# EAGLE design working (EAGLE 6.4)
DATABASE: ./../BOM/logic-supply-db.txt
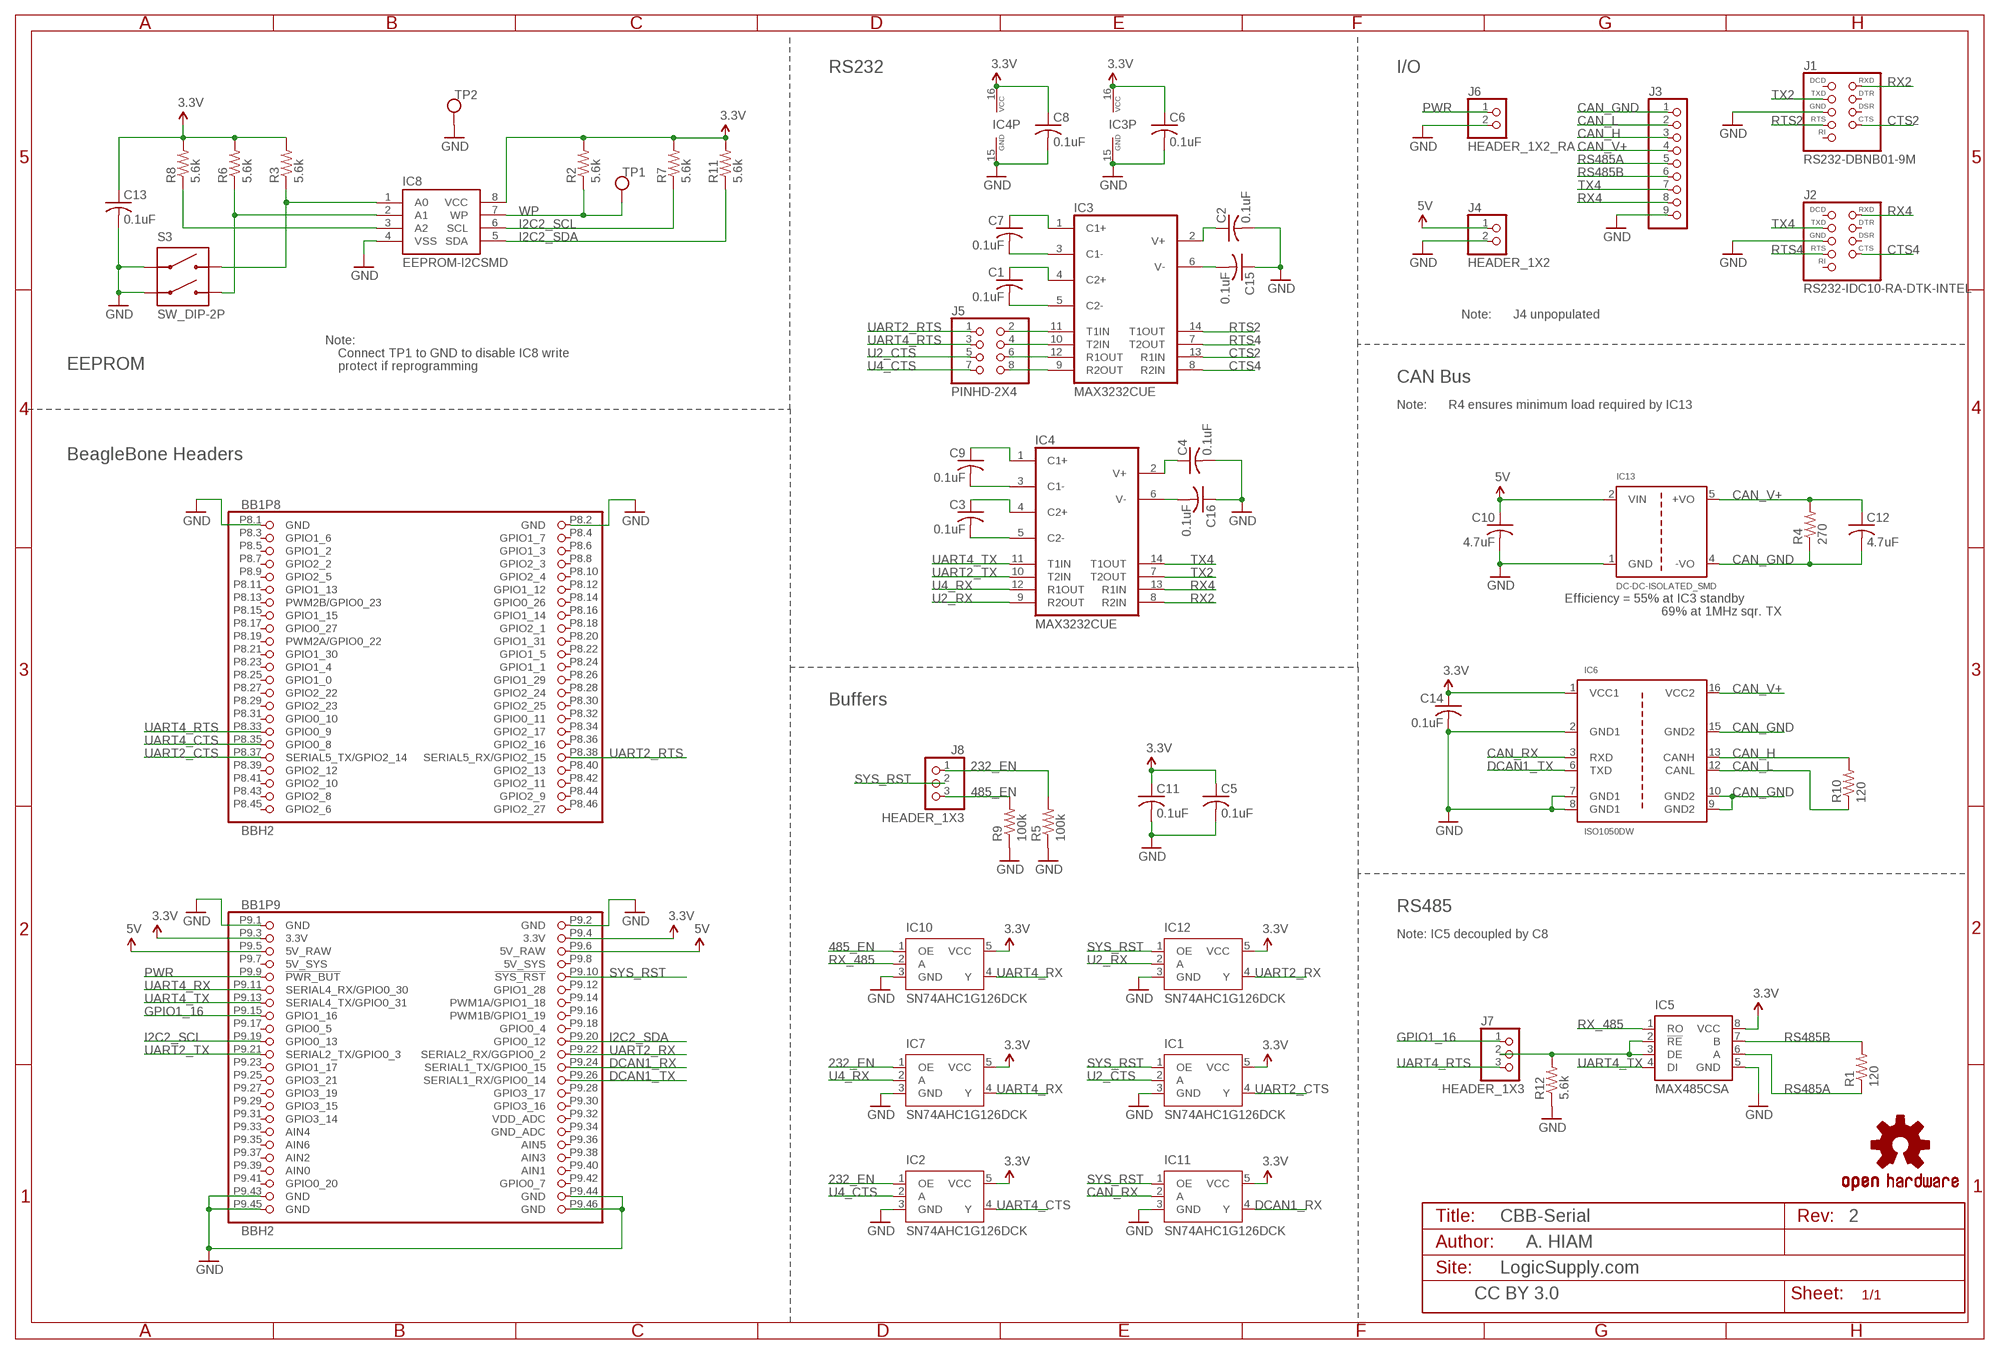
[diagram p0: schematic, sheet 1]

## Parts
BB1  BBH2  [BB_CAPE_TOP]
C1  0.1uF  C-USC0603  [C0603]
C2  0.1uF  C-USC0603  [C0603]
C3  0.1uF  C-USC0603  [C0603]
C4  0.1uF  C-USC0603  [C0603]
C5  0.1uF  C-USC0603  [C0603]
C6  0.1uF  C-USC0603  [C0603]
C7  0.1uF  C-USC0603  [C0603]
C8  0.1uF  C-USC0603  [C0603]
C9  0.1uF  C-USC0603  [C0603]
C10  4.7uF  C-USC0805  [C0805]
C11  0.1uF  C-USC0603  [C0603]
C12  4.7uF  C-USC0805  [C0805]
C13  0.1uF  C-USC0603  [C0603]
C14  0.1uF  C-USC0603  [C0603]
C15  0.1uF  C-USC0603  [C0603]
C16  0.1uF  C-USC0603  [C0603]
IC1  SN74AHC1G126DCK  [DCK-R-PDSO-G5]
IC2  SN74AHC1G126DCK  [DCK-R-PDSO-G5]
IC3  MAX3232CUE  [TSSOP16]
IC4  MAX3232CUE  [TSSOP16]
IC5  MAX485CSA  [SO08]
IC6  ISO1050DW  [SO16W]
IC7  SN74AHC1G126DCK  [DCK-R-PDSO-G5]
IC8  EEPROM-I2CSMD  [SO08]
IC10  SN74AHC1G126DCK  [DCK-R-PDSO-G5]
IC11  SN74AHC1G126DCK  [DCK-R-PDSO-G5]
IC12  SN74AHC1G126DCK  [DCK-R-PDSO-G5]
IC13  DC-DC-ISOLATED_SMD  [DC-DC-SMD]
J1  RS232-DBNB01-9M  [DB9-DBNB01-9M]
J2  RS232-IDC10-RA-DTK-INTEL  [HEADER_2X5-SHROUDED-RA]
J3  SCREWTERM_9PIN_2-54  [SCREWTERM_1725724_9]
J4  HEADER_1X2  [HEADER_1X2]
J5  PINHD-2X4  [HEADER_2X4]
J6  HEADER_1X2_RA  [HEADER_1X2_RA]
J7  HEADER_1X3  [HEADER_1X3]
J8  HEADER_1X3  [HEADER_1X3]
R1  120  R-US_R1206  [R1206]
R2  5.6k  R-US_R0603  [R0603]
R3  5.6k  R-US_R0603  [R0603]
R4  270  R-US_R1206  [R1206]
R5  100k  R-US_R0603  [R0603]
R6  5.6k  R-US_R0603  [R0603]
R7  5.6k  R-US_R0603  [R0603]
R8  5.6k  R-US_R0603  [R0603]
R9  100k  R-US_R0603  [R0603]
R10  120  R-US_R1206  [R1206]
R11  5.6k  R-US_R0603  [R0603]
R12  5.6k  R-US_R0603  [R0603]
S3  SW_DIP-2P  [DIPSWITCH-2P-SMD-1.27]
TP1  TEST_POINT_PTH  [TEST_POINT_PTH]
TP2  TEST_POINT_PTH  [TEST_POINT_PTH]
U$7  OSHW-LOGOM  [OSHW-LOGO-M]

## Nets
3.3V: BB1.P9.3(P9:3.3V) BB1.P9.4(P9:3.3V) C5.1 C6.1 C8.1 C11.1 C13.1 C14.1 IC1.5(VCC) IC2.5(VCC) IC3.16(VCC) IC4.16(VCC) IC5.8(VCC) IC6.1(VCC1) IC7.5(VCC) IC8.8(VCC) IC10.5(VCC) IC11.5(VCC) IC12.5(VCC) R2.2 R3.2 R6.2 R7.2 R8.2 R11.2
5V: BB1.P9.5(P9:5V_RAW) BB1.P9.6(P9:5V_RAW) C10.1 IC13.2(VIN) J4.1
232_EN: IC2.1(OE) IC7.1(OE) J8.1 R5.2
485_EN: IC10.1(OE) J8.3 R9.2
CAN_GND: C12.2 IC6.9(GND2) IC6.10(GND2) IC6.15(GND2) IC13.4(-VO) J3.1 R4.1
CAN_H: IC6.13(CANH) J3.3 R10.2
CAN_L: IC6.12(CANL) J3.2 R10.1
CAN_RX: IC6.3(RXD) IC11.2(A)
CAN_V+: C12.1 IC6.16(VCC2) IC13.5(+VO) J3.4 R4.2
CTS2: IC3.13(R1IN) J1.8(CTS)
CTS4: IC3.8(R2IN) J2.6(CTS)
DCAN1_RX: BB1.P9.24(P9:SERIAL1_TX/GPIO0_15) IC11.4(Y)
DCAN1_TX: BB1.P9.26(P9:SERIAL1_RX/GPIO0_14) IC6.6(TXD)
GND: BB1.P8.1(P8:GND) BB1.P8.2(P8:GND) BB1.P9.1(P9:GND) BB1.P9.2(P9:GND) BB1.P9.43(P9:GND) BB1.P9.44(P9:GND) BB1.P9.45(P9:GND) BB1.P9.46(P9:GND) C2.2 C4.2 C5.2 C6.2 C8.2 C10.2 C11.2 C13.2 C14.2 C15.1 C16.1 IC1.3(GND) IC2.3(GND) IC3.15(GND) IC4.15(GND) IC5.5(GND) IC6.2(GND1) IC6.7(GND1) IC6.8(GND1) IC7.3(GND) IC8.4(VSS) IC10.3(GND) IC11.3(GND) IC12.3(GND) IC13.1(GND) J1.5(GND) J2.9(GND) J3.9 J4.2 J6.2 R5.1 R9.1 R12.1 S3.1A S3.2A TP2.P$1
GPIO1_16: BB1.P9.15(P9:GPIO1_16) J7.1
I2C2_SCL: BB1.P9.19(P9:GPIO0_13) IC8.6(SCL) R7.1
I2C2_SDA: BB1.P9.20(P9:GPIO0_12) IC8.5(SDA) R11.1
N$1: C9.2 IC4.3(C1-)
N$2: C3.2 IC4.5(C2-)
N$3: C9.1 IC4.1(C1+)
N$4: C3.1 IC4.4(C2+)
N$5: C16.2 IC4.6(V-)
N$6: C4.1 IC4.2(V+)
N$7: C15.2 IC3.6(V-)
N$8: C7.2 IC3.3(C1-)
N$9: IC5.2(!RE) IC5.3(DE) J7.2 R12.2
N$10: C1.2 IC3.5(C2-)
N$11: C7.1 IC3.1(C1+)
N$12: C1.1 IC3.4(C2+)
N$13: IC8.1(A0) R3.1 S3.1B
N$14: IC8.2(A1) R6.1 S3.2B
N$15: IC8.3(A2) R8.1
N$17: C2.1 IC3.2(V+)
N$18: IC3.11(T1IN) J5.2
N$19: IC3.12(R1OUT) J5.6
N$20: IC3.10(T2IN) J5.4
N$21: IC3.9(R2OUT) J5.8
PWR: BB1.P9.9(P9:!PWR_BUT) J6.1
RS485A: IC5.6(A) J3.5 R1.1
RS485B: IC5.7(B) J3.6 R1.2
RTS2: IC3.14(T1OUT) J1.7(RTS)
RTS4: IC3.7(T2OUT) J2.4(RTS)
RX2: IC4.8(R2IN) J1.2(RXD)
RX4: IC4.13(R1IN) J2.3(RXD) J3.8
RX_485: IC5.1(RO) IC10.2(A)
SYS_RST: BB1.P9.10(P9:!SYS_RST) IC1.1(OE) IC11.1(OE) IC12.1(OE) J8.2
TX2: IC4.7(T2OUT) J1.3(TXD)
TX4: IC4.14(T1OUT) J2.5(TXD) J3.7
U2_CTS: IC1.2(A) J5.5
U2_RX: IC4.9(R2OUT) IC12.2(A)
U4_CTS: IC2.2(A) J5.7
U4_RX: IC4.12(R1OUT) IC7.2(A)
UART2_CTS: BB1.P8.37(P8:SERIAL5_TX/GPIO2_14) IC1.4(Y)
UART2_RTS: BB1.P8.38(P8:SERIAL5_RX/GPIO2_15) J5.1
UART2_RX: BB1.P9.22(P9:SERIAL2_RX/GGPIO0_2) IC12.4(Y)
UART2_TX: BB1.P9.21(P9:SERIAL2_TX/GPIO0_3) IC4.10(T2IN)
UART4_CTS: BB1.P8.35(P8:GPIO0_8) IC2.4(Y)
UART4_RTS: BB1.P8.33(P8:GPIO0_9) J5.3 J7.3
UART4_RX: BB1.P9.11(P9:SERIAL4_RX/GPIO0_30) IC7.4(Y) IC10.4(Y)
UART4_TX: BB1.P9.13(P9:SERIAL4_TX/GPIO0_31) IC4.11(T1IN) IC5.4(DI)
WP: IC8.7(WP) R2.1 TP1.P$1
Unconnected: BB1.P8.3(P8:GPIO1_6) BB1.P8.4(P8:GPIO1_7) BB1.P8.5(P8:GPIO1_2) BB1.P8.6(P8:GPIO1_3) BB1.P8.7(P8:GPIO2_2) BB1.P8.8(P8:GPIO2_3) BB1.P8.9(P8:GPIO2_5) BB1.P8.10(P8:GPIO2_4) BB1.P8.11(P8:GPIO1_13) BB1.P8.12(P8:GPIO1_12) BB1.P8.13(P8:PWM2B/GPIO0_23) BB1.P8.14(P8:GPIO0_26) BB1.P8.15(P8:GPIO1_15) BB1.P8.16(P8:GPIO1_14) BB1.P8.17(P8:GPIO0_27) BB1.P8.18(P8:GPIO2_1) BB1.P8.19(P8:PWM2A/GPIO0_22) BB1.P8.20(P8:GPIO1_31) BB1.P8.21(P8:GPIO1_30) BB1.P8.22(P8:GPIO1_5) BB1.P8.23(P8:GPIO1_4) BB1.P8.24(P8:GPIO1_1) BB1.P8.25(P8:GPIO1_0) BB1.P8.26(P8:GPIO1_29) BB1.P8.27(P8:GPIO2_22) BB1.P8.28(P8:GPIO2_24) BB1.P8.29(P8:GPIO2_23) BB1.P8.30(P8:GPIO2_25) BB1.P8.31(P8:GPIO0_10) BB1.P8.32(P8:GPIO0_11) BB1.P8.34(P8:GPIO2_17) BB1.P8.36(P8:GPIO2_16) BB1.P8.39(P8:GPIO2_12) BB1.P8.40(P8:GPIO2_13) BB1.P8.41(P8:GPIO2_10) BB1.P8.42(P8:GPIO2_11) BB1.P8.43(P8:GPIO2_8) BB1.P8.44(P8:GPIO2_9) BB1.P8.45(P8:GPIO2_6) BB1.P8.46(P8:GPIO2_27) BB1.P9.12(P9:GPIO1_28) BB1.P9.14(P9:PWM1A/GPIO1_18) BB1.P9.16(P9:PWM1B/GPIO1_19) BB1.P9.17(P9:GPIO0_5) BB1.P9.18(P9:GPIO0_4) BB1.P9.23(P9:GPIO1_17) BB1.P9.25(P9:GPIO3_21) BB1.P9.27(P9:GPIO3_19) BB1.P9.28(P9:GPIO3_17) BB1.P9.29(P9:GPIO3_15) BB1.P9.30(P9:GPIO3_16) BB1.P9.31(P9:GPIO3_14) BB1.P9.32(P9:VDD_ADC) BB1.P9.33(P9:AIN4) BB1.P9.34(P9:GND_ADC) BB1.P9.35(P9:AIN6) BB1.P9.36(P9:AIN5) BB1.P9.37(P9:AIN2) BB1.P9.38(P9:AIN3) BB1.P9.39(P9:AIN0) BB1.P9.40(P9:AIN1) BB1.P9.41(P9:GPIO0_20) BB1.P9.42(P9:GPIO0_7) J1.1(DCD) J1.4(DTR) J1.6(DSR) J1.9(RI) J2.1(DCD) J2.2(DSR) J2.7(DTR) J2.8(RI)

## Notes on the sheet
- RS232 | I/O
- Note: | J4 unpopulated
- Note:
- Connect TP1 to GND to disable IC8 write
- EEPROM | protect if reprogramming
- CAN Bus
- Note: | R4 ensures minimum load required by IC13
- BeagleBone Headers
- Efficiency = 55% at IC3 standby
- 69% at 1MHz sqr. TX
- Buffers
- RS485
- Note: IC5 decoupled by C8
- CBB-Serial | 2
- A. HIAM
- LogicSupply.com
- CC BY 3.0

## Power pins joined to a net without a drawn wire
5V_SYS: BB1.P9.7(P9:5V_SYS) BB1.P9.8(P9:5V_SYS)

## Library data of the parts
BB1 = logic-supply:BBH: BeagleBone header sub-assembly BBH1 outdated, use BBH2 or BBH3 only
C1-C16 = rcl:C-US: CAPACITOR, American symbol
IC1 IC2 IC7 IC10-IC12 = logic-supply:SN74AHC1G126
IC3 IC4 = logic-supply:MAX3232*: True RS-232 Transceivers 3.0V to 5.5V, Low-Power up to 1Mbps, Using Four 0.1µF External Capacitors Source: http://pdfserv.maxim-ic.com/en/ds/MAX3222-MAX3241.pdf; MF: MAXIM; MPN: MAX3232CUE+; OC_FARNELL: 1593350; OC_NEWARK: 68K4629
IC5 = logic-supply:MAX485
IC6 = logic-supply:ISO1050DW
IC8 = logic-supply:EEPROM-I2C: I2C EEPROM chips, 24LC256 (and others)
IC13 = logic-supply:DC-DC-ISOLATED
J1 J2 = logic-supply:RS232: There are two IDC10 heaeder pinouts: *-AT-EVEREX use the AT/Everex standard pinout *-DTK-INTEL use the DTK/Intel standard pinout
J3 = logic-supply:SCREWTERM_9PIN
J4 J6 = logic-supply:HEADER_1X2; BOM: Exclude
J5 = logic-supply:PINHD-2X4: PIN HEADER
J7 J8 = logic-supply:HEADER_1X3
R1-R12 = rcl:R-US_: RESISTOR, American symbol
S3 = logic-supply:SW_DIP-2P
TP1 TP2 = logic-supply:TEST_POINT
U$7 = logic-supply:OSHW-LOGO: Open Source Hardware Logo This logo indicates the piece of hardware it is found on incorporates a OSHW license and/or adheres to the definition of open source hardware found here: http://freedomdefined.org/OSHW From SparkFun-Aesthetics.lbr

## Board
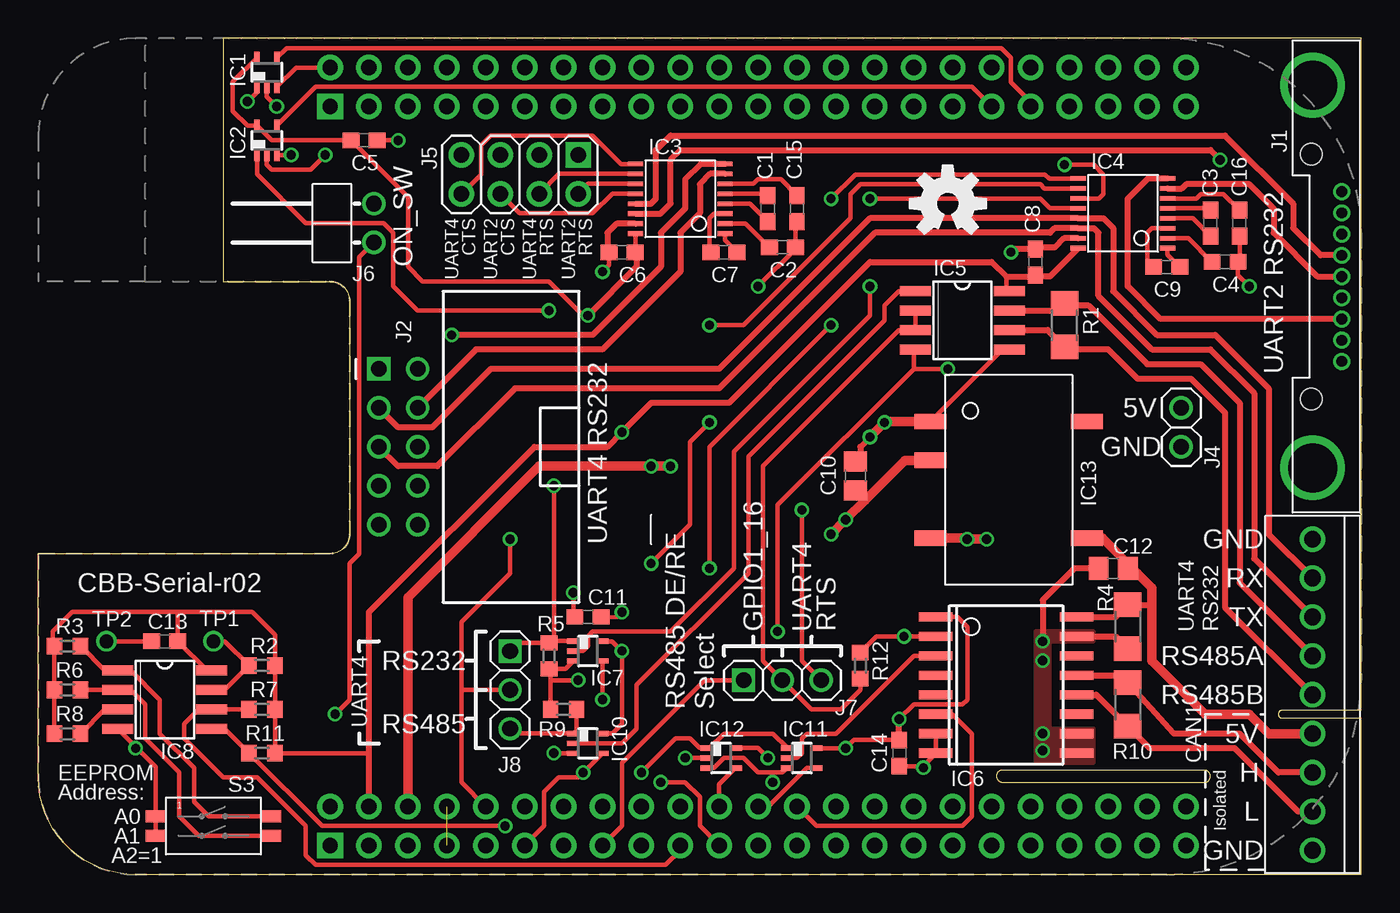
[diagram p1: board, top side]
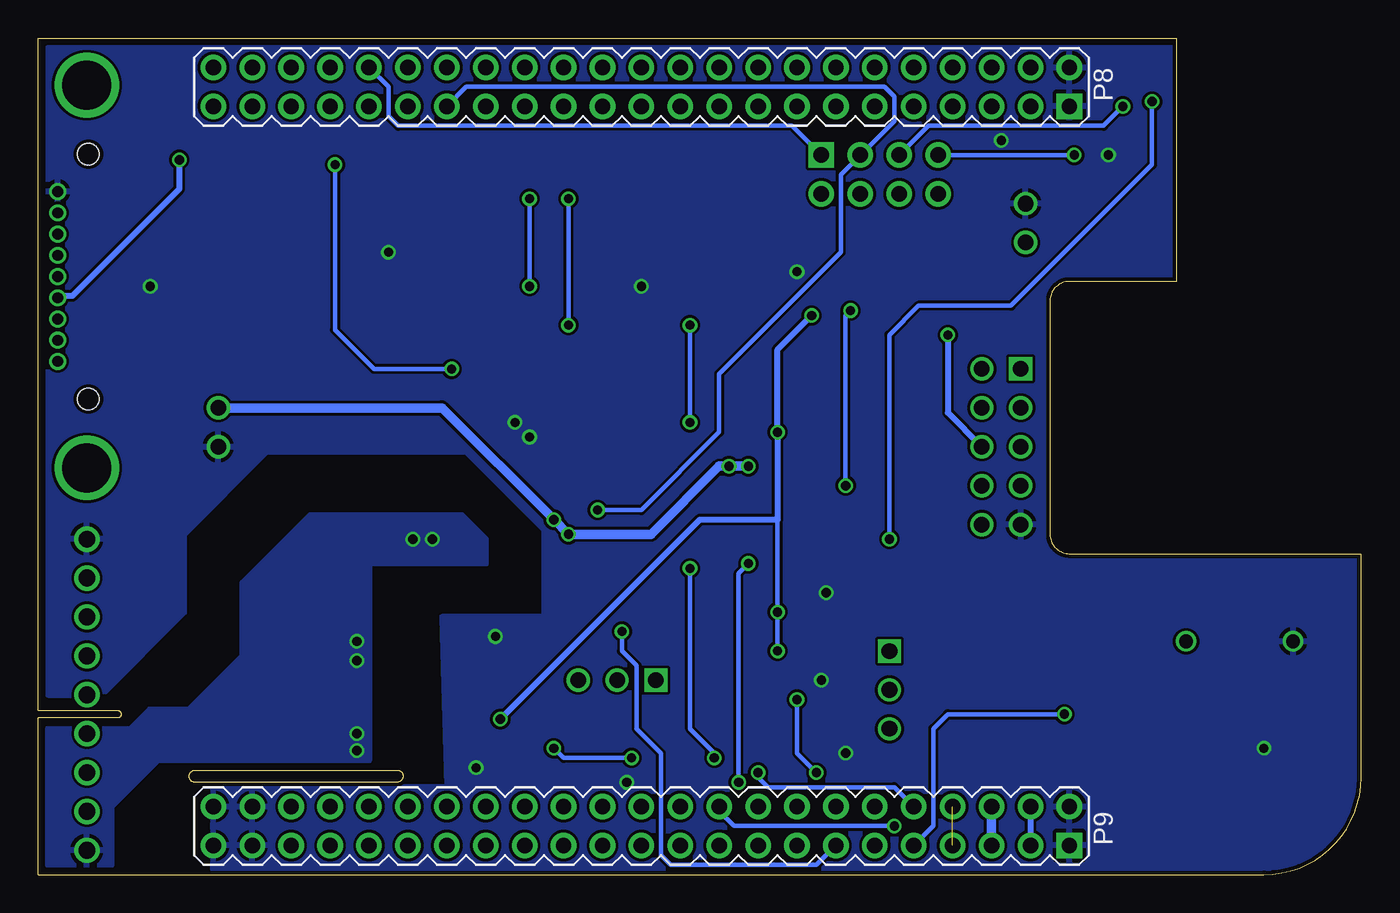
[diagram p2: board, bottom side, seen from below]

Size 86.36 x 54.61 mm. Coordinates in mm from the lower left corner, seen from the top.
Outline: 86.36,0 86.36,10.24 81.15,10.24 arc-90 80.96,10.43 80.96,10.53 arc-90 81.15,10.72 86.36,10.72 86.36,54.61 12.06,54.61 12.06,38.73 19.05,38.73 arc-90 20.32,37.47 20.32,22.23 arc-90 19.05,20.95 0,20.95 0,6.35 arc90 6.35,0 86.36,0
Outline: 62.95,6.03 76.13,6.03 arc90 76.52,6.42 arc90 76.11,6.83 62.94,6.83 arc90 62.55,6.44 arc90 62.95,6.03
Copper layers (1*16): Top 0.0356mm / dielectric 1.5011mm / Bottom 0.0356mm
Design rules "logicsupply": minimum track width 5mil, minimum drill 13mil, track to track 7mil, track to pad 7mil, pad to pad 7mil, via to via 7mil, smd to smd 7mil, copper to edge 10mil, drill to drill 6mil, minimum pad ring 7mil, minimum via ring 7mil, stop-mask expansion 4mil, vias tented up to drill 0mil, thermal gap 10mil

### Footprints (pad centres in the part's own frame; a part is rotated, then mirrored left to right if it is on the bottom)
BB_CAPE_TOP = drill 1 pad 1.676 square: P8.1 50.165,19.05; P9.1 1.905,19.05 | drill 1 pad 1.676: P8.2 52.705,19.05; P8.3 50.165,21.59; P8.4 52.705,21.59; P8.5 50.165,24.13; P8.6 52.705,24.13; P8.7 50.165,26.67; P8.8 52.705,26.67; P8.9 50.165,29.21; P8.10 52.705,29.21; P8.11 50.165,31.75; P8.12 52.705,31.75; P8.13 50.165,34.29; P8.14 52.705,34.29; P8.15 50.165,36.83; P8.16 52.705,36.83; P8.17 50.165,39.37; P8.18 52.705,39.37; P8.19 50.165,41.91; P8.20 52.705,41.91; P8.21 50.165,44.45; P8.22 52.705,44.45; P8.23 50.165,46.99; P8.24 52.705,46.99; P8.25 50.165,49.53; P8.26 52.705,49.53; P8.27 50.165,52.07; P8.28 52.705,52.07; P8.29 50.165,54.61; P8.30 52.705,54.61; P8.31 50.165,57.15; P8.32 52.705,57.15; P8.33 50.165,59.69; P8.34 52.705,59.69; P8.35 50.165,62.23; P8.36 52.705,62.23; P8.37 50.165,64.77; P8.38 52.705,64.77; P8.39 50.165,67.31; P8.40 52.705,67.31; P8.41 50.165,69.85; P8.42 52.705,69.85; P8.43 50.165,72.39; P8.44 52.705,72.39; P8.45 50.165,74.93; P8.46 52.705,74.93; P9.2 4.445,19.05; P9.3 1.905,21.59; P9.4 4.445,21.59; P9.5 1.905,24.13; P9.6 4.445,24.13; P9.7 1.905,26.67; P9.8 4.445,26.67; P9.9 1.905,29.21; P9.10 4.445,29.21; P9.11 1.905,31.75; P9.12 4.445,31.75; P9.13 1.905,34.29; P9.14 4.445,34.29; P9.15 1.905,36.83; P9.16 4.445,36.83; P9.17 1.905,39.37; P9.18 4.445,39.37; P9.19 1.905,41.91; P9.20 4.445,41.91; P9.21 1.905,44.45; P9.22 4.445,44.45; P9.23 1.905,46.99; P9.24 4.445,46.99; P9.25 1.905,49.53; P9.26 4.445,49.53; P9.27 1.905,52.07; P9.28 4.445,52.07; P9.29 1.905,54.61; P9.30 4.445,54.61; P9.31 1.905,57.15; P9.32 4.445,57.15; P9.33 1.905,59.69; P9.34 4.445,59.69; P9.35 1.905,62.23; P9.36 4.445,62.23; P9.37 1.905,64.77; P9.38 4.445,64.77; P9.39 1.905,67.31; P9.40 4.445,67.31; P9.41 1.905,69.85; P9.42 4.445,69.85; P9.43 1.905,72.39; P9.44 4.445,72.39; P9.45 1.905,74.93; P9.46 4.445,74.93
C0603 = smd 1.1 x 1: 1 -0.85,0; 2 0.85,0
C0805 = smd 1.3 x 1.5: 1 -0.95,0; 2 0.95,0
DCK-R-PDSO-G5 = smd 0.35 x 0.8: 1 -0.65,-0.95; 2 0,-0.95; 3 0.65,-0.95; 4 0.65,0.95; 5 -0.65,0.95
TSSOP16 = smd 0.305 x 0.991: 1 -2.275,-2.918; 2 -1.625,-2.918; 3 -0.975,-2.918; 4 -0.325,-2.918; 5 0.325,-2.918; 6 0.975,-2.918; 7 1.625,-2.918; 8 2.275,-2.918; 9 2.275,2.918; 10 1.625,2.918; 11 0.975,2.918; 12 0.325,2.918; 13 -0.325,2.918; 14 -0.975,2.918; 15 -1.625,2.918; 16 -2.275,2.918
SO08 = smd 0.66 x 2.032: 1 -1.905,-3.073; 2 -0.635,-3.073; 3 0.635,-3.073; 4 1.905,-3.073; 5 1.905,3.073; 6 0.635,3.073; 7 -0.635,3.073; 8 -1.905,3.073
SO16W = smd 0.6 x 2.2: 1 -4.445,-4.6; 2 -3.175,-4.6; 3 -1.905,-4.6; 4 -0.635,-4.6; 5 0.635,-4.6; 6 1.905,-4.6; 7 3.175,-4.6; 8 4.445,-4.6; 9 4.445,4.6; 10 3.175,4.6; 11 1.905,4.6; 12 0.635,4.6; 13 -0.635,4.6; 14 -1.905,4.6; 15 -3.175,4.6; 16 -4.445,4.6
DC-DC-SMD = smd 1 x 2.1: 1 -3.81,-5.1; 2 -1.27,-5.1; 4 3.81,-5.1; 5 3.81,5.1; 8 -3.81,5.1
DB9-DBNB01-9M = drill 0.7 pad 1.1: 1 -5.54,0; 2 -2.77,0; 3 0,0; 4 2.77,0; 5 5.54,0; 6 -4.155,0; 7 -1.385,0; 8 1.385,0; 9 4.155,0 | drill 3.2: G1 -12.495,1.9; G2 12.495,1.9 | hole 1.4: -7.99,2; 7.99,2
HEADER_2X5-SHROUDED-RA = drill 1.016 square: 1 -1.27,5.08 | drill 1.016: 2 1.27,5.08; 3 -1.27,2.54; 4 1.27,2.54; 5 -1.27,0; 6 1.27,0; 7 -1.27,-2.54; 8 1.27,-2.54; 9 -1.27,-5.08; 10 1.27,-5.08
SCREWTERM_1725724_9 = drill 1.1: 1 0,0; 2 2.54,0; 3 5.08,0; 4 7.62,0; 5 10.16,0; 6 12.7,0; 7 15.24,0; 8 17.78,0; 9 20.32,0
HEADER_1X2 = drill 1.016: 1 0,0; 2 2.54,0
HEADER_2X4 = drill 1.016 pad 1.676 square: 1 0,0 | drill 1.016 pad 1.676: 2 0,2.54; 3 2.54,0; 4 2.54,2.54; 5 5.08,0; 6 5.08,2.54; 7 7.62,0; 8 7.62,2.54
HEADER_1X2_RA = drill 1.016: 1 0,0; 2 2.54,0
HEADER_1X3 = drill 1.016 square: 1 0,0 | drill 1.016: 2 2.54,0; 3 5.08,0
R1206 = smd 1.6 x 1.803: 1 -1.422,0; 2 1.422,0
R0603 = smd 1 x 1.1: 1 -0.85,0; 2 0.85,0
DIPSWITCH-2P-SMD-1.27 = smd 1.3 x 0.76: 1A -3.775,0.635; 1B 3.775,0.635; 2A -3.775,-0.635; 2B 3.775,-0.635
TEST_POINT_PTH = drill 0.9: P$1 0,0

### Placement (x,y rotation side)
BB1  0,0 90 bottom
C1  47.62,43.5 90 top
C2  48.58,40.96 0 top
C3  76.52,42.55 90 top
C4  77.47,40.01 0 top
C5  21.27,47.94 0 top
C6  38.1,40.64 180 top
C7  44.77,40.64 180 top
C8  65.09,40.01 90 top
C9  73.66,39.69 180 top
C10  53.34,26.04 90 top
C11  35.88,16.83 180 top
C12  70.17,20 180 top
C13  8.26,15.24 180 top
C14  56.2,7.94 270 top
C15  49.53,43.5 90 top
C16  78.42,42.55 90 top
IC1  14.92,52.39 0 top
IC2  14.92,47.94 0 top
IC3  41.91,44.13 90 top
IC4  70.8,43.18 90 top
IC5  60.33,36.2 270 top
IC6  63.18,12.38 270 top
IC7  35.88,14.61 270 top
IC8  8.26,11.43 270 top
IC10  35.88,8.57 270 top
IC11  49.85,7.62 270 top
IC12  44.57,7.62 270 top
IC13  63.34,25.78 270 top
J1  85.09,39.05 90 top
J2  23.5,27.94 0 top
J3  83.19,1.59 90 top
J4  74.61,30.48 270 top
J5  35.24,46.99 180 top
J6  21.91,41.27 90 top
J7  46.04,12.7 0 top
J8  30.8,14.61 270 top
R1  66.99,35.88 90 top
R2  14.61,13.65 0 top
R3  1.91,14.92 180 top
R4  71.12,16.19 90 top
R5  33.34,14.29 90 top
R6  1.91,12.06 180 top
R7  14.61,10.79 0 top
R8  1.91,9.21 180 top
R9  34.29,10.79 0 top
R10  71.12,11.11 90 top
R11  14.61,7.94 0 top
R12  53.66,13.65 270 top
S3  11.43,3.17 0 top
TP1  11.43,15.24 0 top
TP2  4.45,15.24 0 top
U$7  59.37,43.81 0 top

### Tracks (layer width: path | path; a pad name or v marks a point on that pad's centre or on a via)
3.3V  (via drill 0.6)
  Top 0.254: C11.1 37.78,16.83 v38.1,17.14
  Top 0.305: IC10.5 37.48,9.22 38.1,9.84 v38.1,14.61 37.47,15.24 36.84,15.24 IC7.5 | C14.1 53.24,8.79 v52.7,8.26 50.49,8.26 IC11.5 | IC1.5 12.7,51.77 12.7,49.85 13.65,48.89 IC2.5 15.22,47.94 C5.1 24.13,44.23 24.13,39.69 25.08,38.73 33.34,38.73 35.56,36.51 v35.88,36.51 | IC3.16 38.99,40.68 C6.1 | IC12.5 46.98,8.27 v47.62,7.62 | IC6.1 60.01,16.83 60.64,16.19 60.64,11.43 60.33,11.11 57.15,11.11 v56.2,10.16 | 63.18,39.05 63.18,38.32 IC5.8 | IC8.8 11.01,13.34 C13.1 9.11,17.04 9.21,17.14 | 21.59,7.94 R11.2 R7.2 R2.2 15.46,15.66 13.97,17.14 9.21,17.14 | R8.2 R6.2 R3.2 0.95,15.03 0.95,15.88 2.22,17.14 9.21,17.14
  Top 0.406: C14.1 56.41,8.57 56.2,8.89 v56.2,10.16 | BB1.P9.4 21.59,7.94 21.59,17.14 32.38,27.94 37.15,27.94 v38.1,28.89 40.01,30.8 45.09,30.8 54.29,40.01 62.23,40.01 63.18,39.05 64.98,39.05 C8.1 65.19,39.05 66.04,39.05 67.89,40.9 IC4.16 | C6.1 39.05,40.54 39.05,39.69 v35.88,36.51
  Bottom 0.305: v47.62,7.62 52.07,7.62 v52.7,8.26 | 38.1,23.18 v38.1,17.14 v38.1,14.61
  Bottom 0.406: v35.88,36.51 38.1,34.29 v38.1,28.89 38.1,23.18 43.18,23.18 v56.2,10.16 | BB1.P9.4 BB1.P9.3
5V  (via drill 0.6)
  Top 0.406: C10.1 53.98,24.45
  Top 0.61: v51.75,22.23 v52.7,23.18 53.98,24.45 56.58,27.05 IC13.2 | v41.27,26.67 v40.01,26.67 32.7,26.67 24.13,18.1 BB1.P9.6
  Bottom 0.61: v40.01,26.67 41.91,26.67 46.35,22.23 v51.75,22.23 v52.7,23.18 60.01,30.48 J4.1 | BB1.P9.5 BB1.P9.6
5V_SYS  (1 unrouted)
232_EN  (via drill 0.6)
  Top 0.305: v33.34,36.83 24.77,36.83 23.18,38.42 23.18,41.91 22.54,42.55 17.46,42.55 14.27,45.73 IC2.1 | IC7.1 33.45,15.26 R5.2 | R5.2 33.66,15.46 v33.66,25.4 | R5.2 31.33,15.14 J8.1
  Bottom 0.305: v33.66,25.4 33.66,36.51 v33.34,36.83
485_EN
  Top 0.305: R9.2 35.14,9.44 IC10.1 31.1,9.22 J8.3
CAN_GND  (via drill 0.6)
  Top 0.406: C12.2 67.63,20 65.56,17.94 v65.56,15.24 | IC6.15 70.33,15.56 R4.1
  Top 0.61: IC13.4 60.58,21.97 v60.64,21.91 v61.91,21.91
  other vias: 65.56,9.21 65.56,8.1 65.56,13.97
  pour Bottom: 85.72,0.64 85.72,9.53 80.33,9.53 79.06,10.79 76.52,10.79 73.03,14.29 73.03,19.05 68.58,23.5 58.74,23.5 57.15,21.91 57.15,20.32 64.77,20.32 64.77,7.46 78.58,7.46 81.6,4.45 81.6,0.64
  pour Top (no thermals): 68.9,15.88 65.09,15.88 65.09,7.3 68.9,7.3 68.9,9.53 66.04,9.53 66.04,15.24 68.9,15.24
CAN_H
  Top 0.406: J3.3 80.96,6.67 78.42,9.21 74.13,9.21 R10.2 70.32,13.02 IC6.13
CAN_L
  Top 0.406: IC6.12 69.06,11.75 R10.1 72.56,8.26 78.11,8.26 82.23,4.13 J3.2
CAN_RX
  Top 0.305: IC6.3 57.15,14.29 52.07,9.21 50.16,9.21 49.85,8.89 49.85,7.94 49.53,7.62 IC11.2
CAN_V+
  Top 0.406: IC6.16 70.33,16.83 R4.2 72.54,17.61 72.71,17.78
  Top 0.61: J3.4 80.33,9.21 79.06,10.48 76.2,10.48 72.71,13.97 72.71,17.78 72.71,18.73 71.75,19.68 | 71.75,19.68 69.47,21.97 IC13.5 | C12.1 71.75,19.68
CTS2
  Top 0.406: IC3.13 40,43.81 40.32,44.13 40.32,47.31 41.27,48.26 77.47,48.26 81.92,43.81 81.92,42.23 83.7,40.44 J1.8
CTS4  (via drill 0.6)
  Top 0.406: IC3.8 43.23,46.41 42.23,45.4 42.23,43.5 40.64,41.91 40.64,39.69 36.2,35.24 v26.99,35.24
  Bottom 0.406: v26.99,35.24 26.99,30.16 J2.6
DCAN1_RX
  Top 0.305: BB1.P9.24 47.62,4.45 50.16,6.99 50.78,6.99 IC11.4
DCAN1_TX
  Top 0.305: IC6.6 59.69,10.48 60.96,9.21 60.96,3.81 60.33,3.17 50.8,3.17 BB1.P9.26
GND  (via drill 0.6)
  Top 0.305: S3.2A S3.1A 7.66,7.05 6.4,8.31 | IC1.3 16.83,52.7 BB1.P8.2 | IC7.3 34.41,13.44 R5.1 33.44,13.44 33.44,12.7 | IC12.3 44.12,6.97 44.77,7.62 46.04,7.62 46.99,6.67 47.94,6.67 | 47.94,6.67 48.58,6.67 | 48.58,6.67 48.59,6.67 IC11.3 48.88,6.97 48.58,6.67 | v47.94,6.03 47.94,6.67 | 33.66,10.9 R9.1 33.44,12.7 | IC10.3 33.67,7.92 v33.66,7.94 | v35.24,12.7 33.44,12.7 | IC2.3 v16.51,46.99 | C11.2 34.92,17.14 v34.92,18.41 | C5.2 v23.5,47.94 | C6.2 37.25,39.79 v36.83,39.37 | C15.1 49.43,42.55 C2.2 49.43,40.85 v46.99,38.42 | C16.1 78.42,40.11 C4.2 78.32,39.16 v79.06,38.42 | C14.2 57.73,7.09 | 57.73,7.09 IC6.8 IC6.7 | IC6.2 v56.52,15.56 54.71,15.56 R12.1 | v57.78,6.99 57.78,7.04 57.73,7.09 | IC5.5 62.94,34.29 IC13.1 | 6.4,8.31 IC8.4 | C13.2 TP2.P$1 | v6.35,8.26 6.4,8.31
  Top 0.406: IC3.15 37.74,42.51 37.15,41.91 37.15,40.74 C6.2 | IC4.15 66.95,41.55 66.36,40.96 65.19,40.96 C8.2 63.72,40.85 v63.5,40.64 | v54.29,28.57 53.66,27.94 53.66,27.3 C10.2
  Top 0.61: v54.29,28.57 v55.24,29.53 55.24,29.59 IC13.1
  pour Bottom: 0,53.98 85.72,53.98 85.72,11.75 82.23,11.75 76.83,17.14 76.83,22.23 71.44,27.62 58.42,27.62 53.34,22.54 53.34,16.83 60.01,16.83 59.69,5.71 74.93,5.71 74.93,0 0,0
GPIO1_16
  Top 0.305: BB1.P9.15 38.1,3.17 38.1,7.3 43.5,12.7 J7.1
I2C2_SCL
  Top 0.305: BB1.P9.19 41.91,1.59 40.96,0.64 18.1,0.64 17.46,1.27 17.46,3.17 14.29,6.35 12.06,6.35 9.53,8.89 9.53,9.84 10.48,10.79 IC8.6 R7.1
I2C2_SDA  (via drill 0.6)
  Top 0.305: v30.48,3.17 18.52,3.17 R11.1 12.17,9.53 IC8.5
  Bottom 0.305: v30.48,3.17 40.96,3.17 41.91,4.13 BB1.P9.20
N$1
  Top 0.305: IC4.3 72.69,42.2 72.39,41.91 72.39,40.11 C9.2
N$2
  Top 0.305: IC4.5 76.41,43.51 C3.2
N$3
  Top 0.305: IC4.1 73.72,40.48 C9.1
N$4
  Top 0.305: IC4.4 75.36,42.85 C3.1
N$5
  Top 0.305: IC4.6 75.59,44.16 75.88,44.45 77.37,44.45 C16.2
N$6
  Top 0.305: IC4.2 75.07,41.55 C4.1
N$7
  Top 0.305: IC3.6 46.7,45.11 46.99,45.4 48.48,45.4 C15.2
N$8
  Top 0.305: IC3.3 44.11,43.16 43.81,42.86 43.81,41.06 C7.2
N$9
  Top 0.305: R12.2 53.66,12.06 52.39,10.79 50.48,10.79 J7.2 47.31,13.97 47.31,26.67 56.2,35.56 IC5.3 IC5.2
N$10
  Top 0.305: IC3.5 47.52,44.46 C1.2
N$11
  Top 0.305: IC3.1 44.83,41.43 C7.1
N$12
  Top 0.305: IC3.4 46.47,43.81 C1.1
N$13
  Top 0.305: R3.1 4.34,13.34 IC8.1 6.03,13.34 7.94,11.43 7.94,9.21 10.16,6.99 10.16,4.76 11.11,3.81 S3.1B
N$14
  Top 0.305: R6.1 IC8.2 6.03,12.06 6.99,11.11 6.99,8.89 9.21,6.67 9.21,3.81 10.48,2.54 S3.2B
N$15
  Top 0.305: IC8.3 4.34,10.79 R8.1
N$17
  Top 0.305: IC3.2 46.18,42.51 C2.1
N$18
  Top 0.305: IC3.11 35.9,45.11 J5.2
N$19
  Top 0.305: IC3.12 37.47,44.46 36.2,43.18 31.43,43.18 J5.6
N$20
  Top 0.305: IC3.10 34.01,45.76 J5.4
N$21
  Top 0.305: IC3.9 38.05,46.41 36.2,48.26 29.53,48.26 28.89,47.62 28.89,45.72 J5.8
N$23
  pour Bottom (no thermals): 71.12,5.71 71.12,0.32 74.93,0.32 74.93,5.71
PWR  (via drill 0.6)
  Top 0.305: v19.37,10.48 20.32,11.43 20.32,20.32 20.95,20.95 20.95,40.32 J6.1
  Bottom 0.305: BB1.P9.9 27.94,3.17 27.94,9.53 26.99,10.48 v19.37,10.48
RS485A
  Top 0.406: J3.5 77.47,17.46 77.47,30.16 75.25,32.38 71.75,32.38 69.85,34.29 67.16,34.29 R1.1 65.89,35.56 IC5.6
RS485B
  Top 0.406: J3.6 78.42,19.05 78.42,30.8 75.88,33.34 72.39,33.34 68.58,37.15 67.14,37.15 R1.2 66.52,36.83 IC5.7
RTS2  (via drill 0.6)
  Top 0.406: IC3.14 40.62,43.16 41.27,43.81 41.27,46.67 41.91,47.31 76.52,47.31 v77.15,46.67
  Bottom 0.406: v77.15,46.67 77.15,44.77 84.14,37.78 84.97,37.78 J1.7
RTS4
  Top 0.406: IC3.7 43.85,45.76 43.18,45.09 43.18,43.18 41.91,41.91 41.91,39.37 36.83,34.29 28.57,34.29 J2.4
RX2
  Top 0.406: J1.2 73.25,36.28 71.12,38.42 71.12,44.13 72.44,45.45 IC4.8
RX4
  Top 0.406: J3.8 80.33,22.23 80.33,31.75 76.83,35.24 73.03,35.24 70.17,38.1 70.17,42.23 69.54,42.85 IC4.13 54.28,42.85 44.45,33.02 29.53,33.02 25.72,29.21 23.5,29.21 J2.3
RX_485
  Top 0.305: IC10.2 38.1,8.57 39.05,9.53 39.05,12.38 46.35,19.68 46.35,27.3 55.24,36.2 55.24,37.15 56.2,38.1 IC5.1
SYS_RST  (via drill 0.6)
  Top 0.305: IC1.1 14.27,51.1 v13.65,50.48 | v30.8,21.91 30.8,19.68 27.62,16.51 27.62,12.06 | 27.62,12.06 27.62,6.03 BB1.P9.10 | IC11.1 47.96,9.21 44.77,9.21 43.83,8.27 IC12.1 43.17,8.27 42.55,8.89 41.59,8.89 v39.37,6.67 | J8.2 27.62,12.06
  Bottom 0.305: v13.65,50.48 13.65,46.35 22.86,37.15 28.89,37.15 30.8,35.24 v30.8,21.91 | v39.37,6.67 39.37,6.35 38.73,5.71 30.48,5.71 BB1.P9.10
TX2
  Top 0.406: J1.3 83.5,39.05 80.64,41.91 80.64,43.5 79.06,45.09 74.93,45.09 74.65,44.8 IC4.7
TX4
  Top 0.406: J3.7 79.38,20.64 79.38,31.43 76.52,34.29 72.71,34.29 69.22,37.78 69.22,41.91 68.92,42.2 IC4.14 66.33,42.2 66.04,41.91 54.61,41.91 44.45,31.75 31.11,31.75 26.04,26.67 23.5,26.67 J2.5
U2_CTS  (via drill 0.6)
  Top 0.305: IC1.2 14.92,50.8 v15.56,50.16
  Bottom 0.305: J5.5 28.26,48.9 16.83,48.9 v15.56,50.16
U2_RX  (via drill 0.6)
  Top 0.305: IC4.9 65.99,45.45 65.72,45.72 53.34,45.72 v51.75,44.13 | IC12.2 42.32,7.62 v42.23,7.62 | v51.75,35.88 43.81,27.94 v43.81,20
  Bottom 0.305: v42.23,7.62 42.23,7.94 43.81,9.53 v43.81,20 | v51.75,35.88 v51.75,44.13
U4_CTS  (via drill 0.6)
  Top 0.305: IC2.2 14.92,46.35 15.24,46.04 17.78,46.04 v18.73,46.99
  Bottom 0.305: v18.73,46.99 J5.7
U4_RX  (via drill 0.6)
  Top 0.305: IC7.2 35.56,14.61 35.88,14.92 35.88,15.56 36.2,15.88 41.27,15.88 45.4,20 45.4,27.62 54.29,36.51 v54.29,38.42 | v54.29,44.13 65.41,44.13 66.03,43.51 IC4.12
  Bottom 0.305: v54.29,38.42 v54.29,44.13
UART2_CTS
  Top 0.305: IC1.4 16.21,53.98 62.87,53.98 63.5,53.34 63.5,51.75 64.77,50.48 BB1.P8.37
UART2_RTS
  Bottom 0.305: J5.1 37.15,48.9 62.87,48.9 63.5,49.53 63.5,51.44 BB1.P8.38
UART2_RX
  Top 0.305: IC12.4 44.45,5.89 BB1.P9.22
UART2_TX  (via drill 0.6)
  Top 0.305: IC4.10 65.69,44.8 65.41,45.09 53.66,45.09 53.02,44.45 53.02,42.86 46.04,35.88 v43.81,35.88 | v40.64,6.03 42.23,6.03 43.18,5.08 43.18,3.17 BB1.P9.21 | v43.81,29.53 42.55,28.26 42.55,22.86 v40.01,20.32
  Bottom 0.305: v43.81,29.53 v43.81,35.88 | v40.64,6.03 40.64,19.68 v40.01,20.32
UART4_CTS
  Top 0.305: 15.56,48.91 IC2.4 16.19,49.53 18.1,51.44 60.96,51.44 BB1.P8.35
UART4_RTS  (via drill 0.6)
  Top 0.305: v49.85,23.81 49.85,13.97 J7.3
  Bottom 0.305: v49.85,23.81 46.99,23.81 41.91,28.89 41.91,32.7 33.97,40.64 33.97,45.72 J5.3 30.48,49.21 30.48,50.8 31.11,51.44 58.42,51.44 BB1.P8.33
UART4_RX  (via drill 0.6)
  Top 0.305: IC10.4 v35.57,6.66 35.26,6.35 33.97,6.35 33.02,5.4 33.02,3.17 BB1.P9.11 | IC7.4 v36.83,11.43
  Bottom 0.305: v36.83,11.43 IC10.4 v35.57,6.66
UART4_TX  (via drill 0.6)
  Top 0.305: 57.15,33.02 48.26,24.13 v48.26,15.88 | 57.15,33.02 57.15,34.01 57.25,34.11 IC5.4 | IC4.11 69.24,44.16 69.53,44.45 69.53,45.72 68.9,46.35 v66.99,46.35 | v59.37,33.02 57.15,33.02
  Bottom 0.305: v66.99,46.35 66.99,35.56 64.45,33.02 v59.37,33.02 | BB1.P9.13 35.56,0.64 45.09,0.64 45.72,1.27 45.72,7.94 47.31,9.53 47.31,13.65 48.26,14.61 v48.26,15.88
WP
  Top 0.305: TP1.P$1 12.17,15.24 R2.1 12.17,12.06 IC8.7

### Text on the board
tPlace: UART4 | CTS | UART2 | CTS | UART4 | RTS | UART2 | RTS | ON_SW | UART2 RS232 | 5V | GND | UART4 RS232 | GND | RX | CBB-Serial-r02 | TX | GPIO1_16 | UART4 | RTS | UART4 | RS232 | RS232 | UART4 | RS485A | RS485B | RS485 DE/RE | Select | RS485 | 5V | EEPROM | CAN1 | H | Address: | A0 | L | A1 | Isolated | GND | A2=1